# EAGLE schematic encore Control Board (EAGLE 9.6.2)
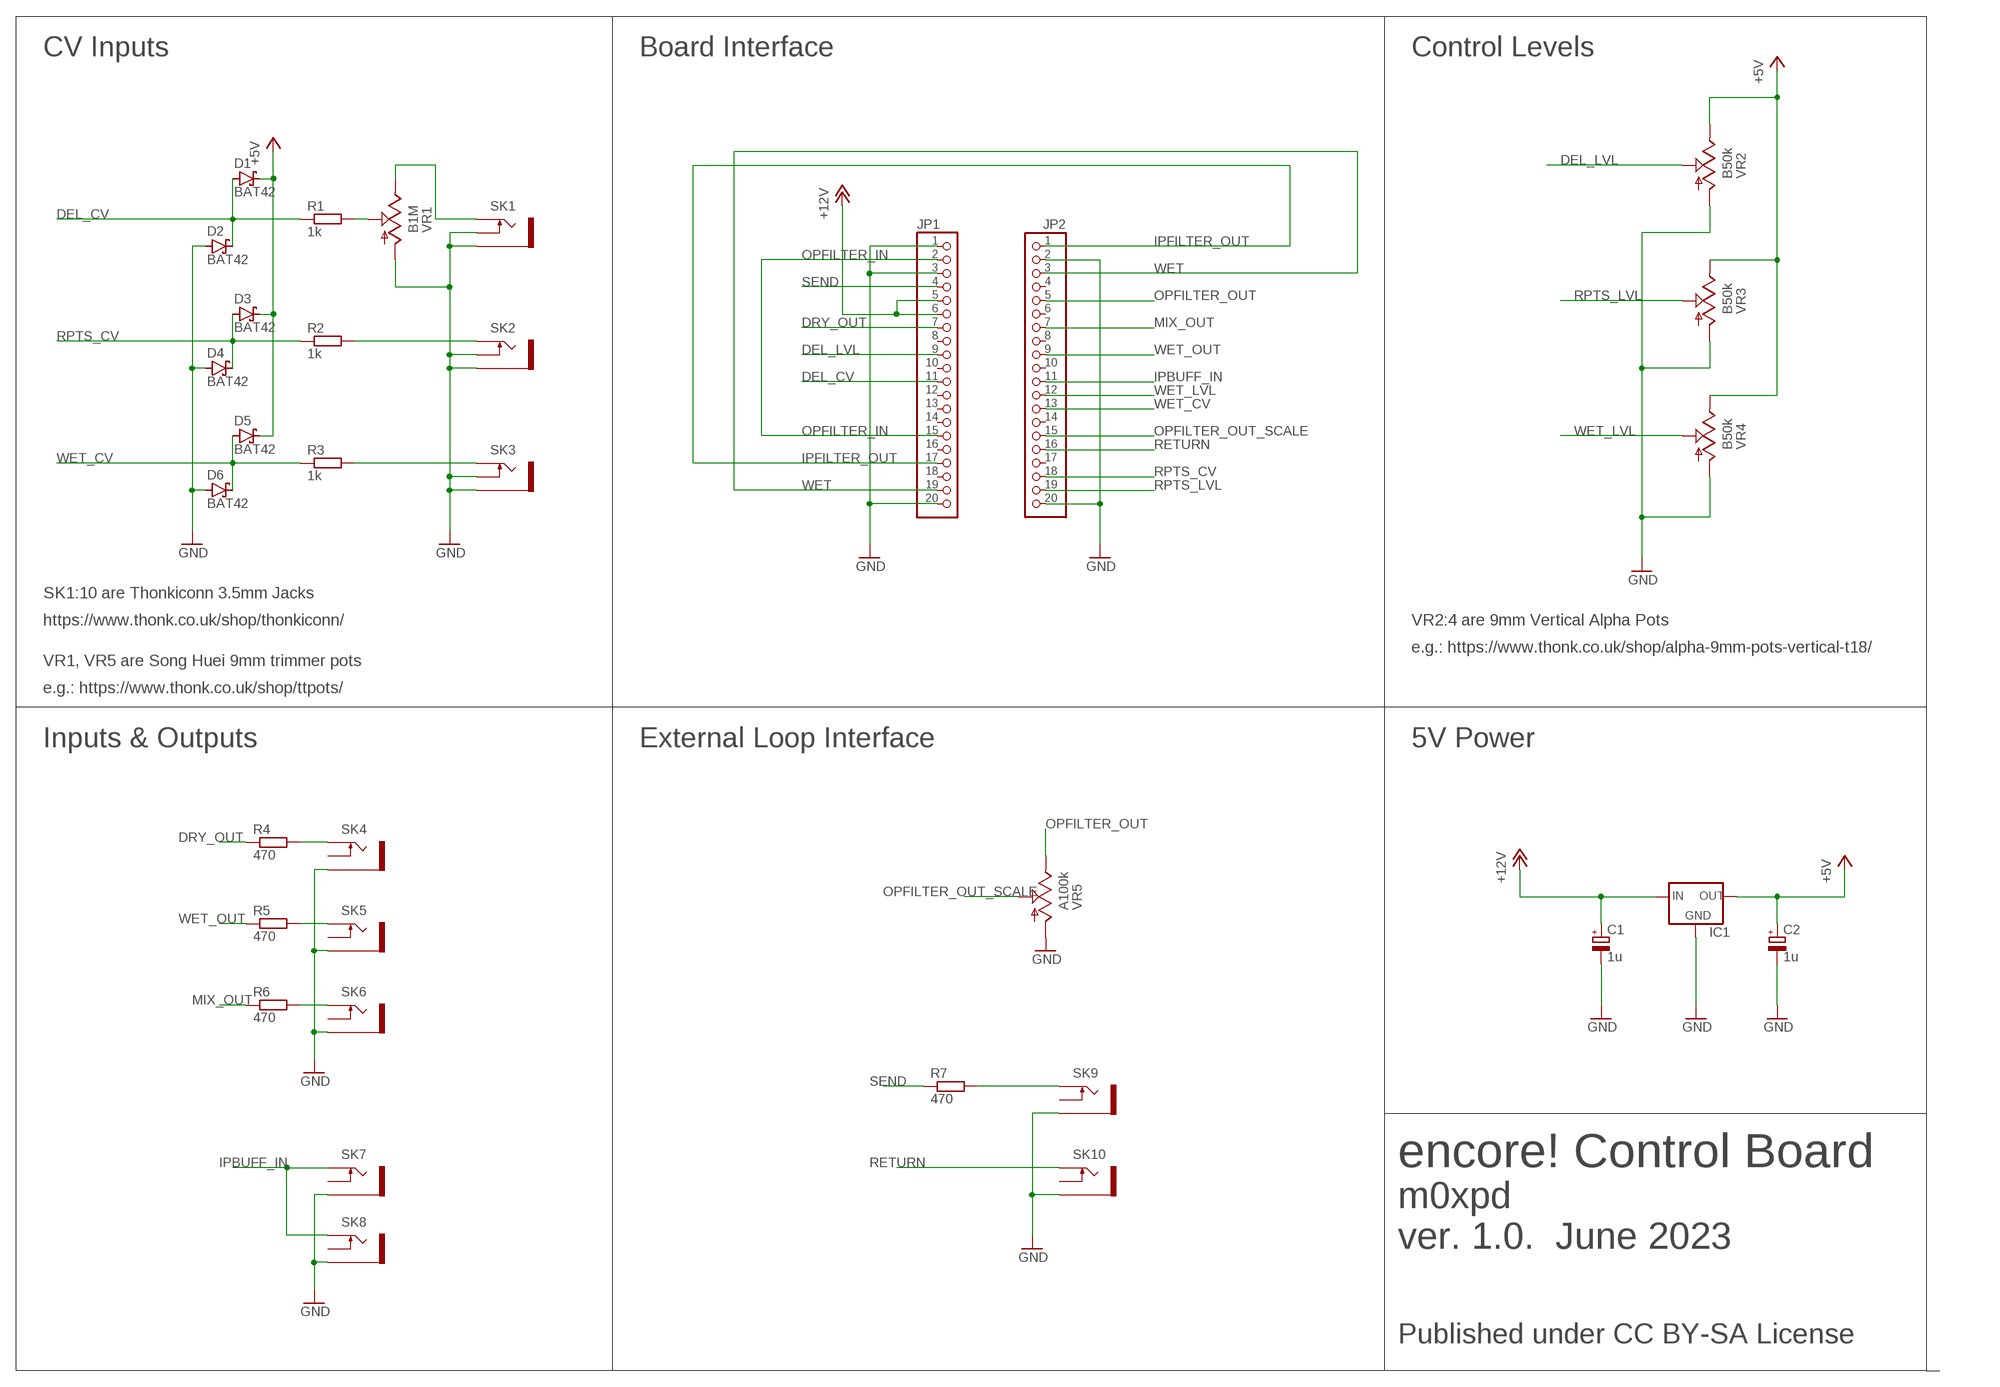
[diagram p0: schematic, sheet 1]

## Parts
C1  1u  CPOL-EUE2.5-5  [E2,5-5]
C2  1u  CPOL-EUE2.5-5  [E2,5-5]
D1  BAT42  [DO35-10]
D2  BAT42  [DO35-10]
D3  BAT42  [DO35-10]
D4  BAT42  [DO35-10]
D5  BAT42  [DO35-10]
D6  BAT42  [DO35-10]
IC1  78LXX  [78LXX]
JP1  PINHD-1X20  [1X20]
JP2  PINHD-1X20  [1X20]
R1  1k  R-EU_0204/7  [0204/7]
R2  1k  R-EU_0204/7  [0204/7]
R3  1k  R-EU_0204/7  [0204/7]
R4  470  R-EU_0204/7  [0204/7]
R5  470  R-EU_0204/7  [0204/7]
R6  470  R-EU_0204/7  [0204/7]
R7  470  R-EU_0204/7  [0204/7]
SK1  THONKICONN_JACK  [WQP-PJ301M-12_JACK]
SK2  THONKICONN_JACK  [WQP-PJ301M-12_JACK]
SK3  THONKICONN_JACK  [WQP-PJ301M-12_JACK]
SK4  THONKICONN_JACK  [WQP-PJ301M-12_JACK]
SK5  THONKICONN_JACK  [WQP-PJ301M-12_JACK]
SK6  THONKICONN_JACK  [WQP-PJ301M-12_JACK]
SK7  THONKICONN_JACK  [WQP-PJ301M-12_JACK]
SK8  THONKICONN_JACK  [WQP-PJ301M-12_JACK]
SK9  THONKICONN_JACK  [WQP-PJ301M-12_JACK]
SK10  THONKICONN_JACK  [WQP-PJ301M-12_JACK]
VR1  B1M  9MM_SNAP-IN_POT_  [9MM_SNAP-IN_POT]
VR2  B50k  9MM_SNAP-IN_POT_  [9MM_SNAP-IN_POT]
VR3  B50k  9MM_SNAP-IN_POT_  [9MM_SNAP-IN_POT]
VR4  B50k  9MM_SNAP-IN_POT_  [9MM_SNAP-IN_POT]
VR5  A100k  9MM_SNAP-IN_POT_  [9MM_SNAP-IN_POT]

## Nets
+5V: C2.+ D1.C D3.C D5.C IC1.OUT VR2.3(E) VR3.3(E) VR4.3(E)
+12V: C1.+ IC1.IN JP1.5 JP1.6
DEL_CV: D1.A D2.C JP1.11 R1.1
DEL_LVL: JP1.9 VR2.2(S)
DRY_OUT: JP1.7 R4.1
GND: C1.- C2.- D2.A D4.A D6.A IC1.GND JP1.1 JP1.3 JP1.20 JP2.2 JP2.20 SK1.P$2_SWITCH(SWITCH) SK1.P$3_SLEEVE(SLEEVE) SK2.P$2_SWITCH(SWITCH) SK2.P$3_SLEEVE(SLEEVE) SK3.P$2_SWITCH(SWITCH) SK3.P$3_SLEEVE(SLEEVE) SK4.P$3_SLEEVE(SLEEVE) SK5.P$3_SLEEVE(SLEEVE) SK6.P$3_SLEEVE(SLEEVE) SK7.P$3_SLEEVE(SLEEVE) SK8.P$3_SLEEVE(SLEEVE) SK9.P$3_SLEEVE(SLEEVE) SK10.P$3_SLEEVE(SLEEVE) VR1.1(A) VR2.1(A) VR3.1(A) VR4.1(A) VR5.1(A)
IPBUFF_IN: JP2.11 SK7.P$1_TIP(TIP) SK8.P$1_TIP(TIP)
IPFILTER_OUT: JP1.17 JP2.1
MIX_OUT: JP2.7 R6.1
N$2: R4.2 SK4.P$1_TIP(TIP)
N$3: R5.2 SK5.P$1_TIP(TIP)
N$4: R6.2 SK6.P$1_TIP(TIP)
N$9: R7.2 SK9.P$1_TIP(TIP)
N$15: SK1.P$1_TIP(TIP) VR1.3(E)
N$17: R2.2 SK2.P$1_TIP(TIP)
N$18: R3.2 SK3.P$1_TIP(TIP)
N$19: R1.2 VR1.2(S)
OPFILTER_IN: JP1.2 JP1.15
OPFILTER_OUT: JP2.5 VR5.3(E)
OPFILTER_OUT_SCALE: JP2.15 VR5.2(S)
RETURN: JP2.16 SK10.P$1_TIP(TIP)
RPTS_CV: D3.A D4.C JP2.18 R2.1
RPTS_LVL: JP2.19 VR3.2(S)
SEND: JP1.4 R7.1
WET: JP1.19 JP2.3
WET_CV: D5.A D6.C JP2.13 R3.1
WET_LVL: JP2.12 VR4.2(S)
WET_OUT: JP2.9 R5.1
Unconnected: JP1.8 JP1.10 JP1.12 JP1.13 JP1.14 JP1.16 JP1.18 JP2.4 JP2.6 JP2.8 JP2.10 JP2.14 JP2.17 SK4.P$2_SWITCH(SWITCH) SK5.P$2_SWITCH(SWITCH) SK6.P$2_SWITCH(SWITCH) SK7.P$2_SWITCH(SWITCH) SK8.P$2_SWITCH(SWITCH) SK9.P$2_SWITCH(SWITCH) SK10.P$2_SWITCH(SWITCH)

## Notes on the sheet
- CV Inputs | Board Interface | Control Levels
- SK1:10 are Thonkiconn 3.5mm Jacks
- https://www.thonk.co.uk/shop/thonkiconn/ | VR2:4 are 9mm Vertical Alpha Pots
- e.g.: https://www.thonk.co.uk/shop/alpha-9mm-pots-vertical-t18/
- VR1, VR5 are Song Huei 9mm trimmer pots
- e.g.: https://www.thonk.co.uk/shop/ttpots/
- Inputs & Outputs | External Loop Interface | 5V Power
- encore! Control Board
- m0xpd
- ver. 1.0.  June 2023
- Published under CC BY-SA License

## Library data of the parts
C1 C2 = rcl:CPOL-EU: POLARIZED CAPACITOR, European symbol; SPICEPREFIX: C
D1-D6 = diode:BAT42: DIODE barrier diode
IC1 = v-reg:78LXX: VOLTAGE REGULATOR
JP1 JP2 = pinhead:PINHD-1X20: PIN HEADER
R1-R7 = rcl:R-EU_: RESISTOR, European symbol; SPICEPREFIX: R
SK1-SK10 = MyLibrary:THONKICONN_JACK
VR1-VR5 = MusicThingModular:9MM_SNAP-IN_POT: 9mm vertical snap-in pot, Alpha / Panasonic style